# EAGLE schematic backplane2 (EAGLE 6.6.0)
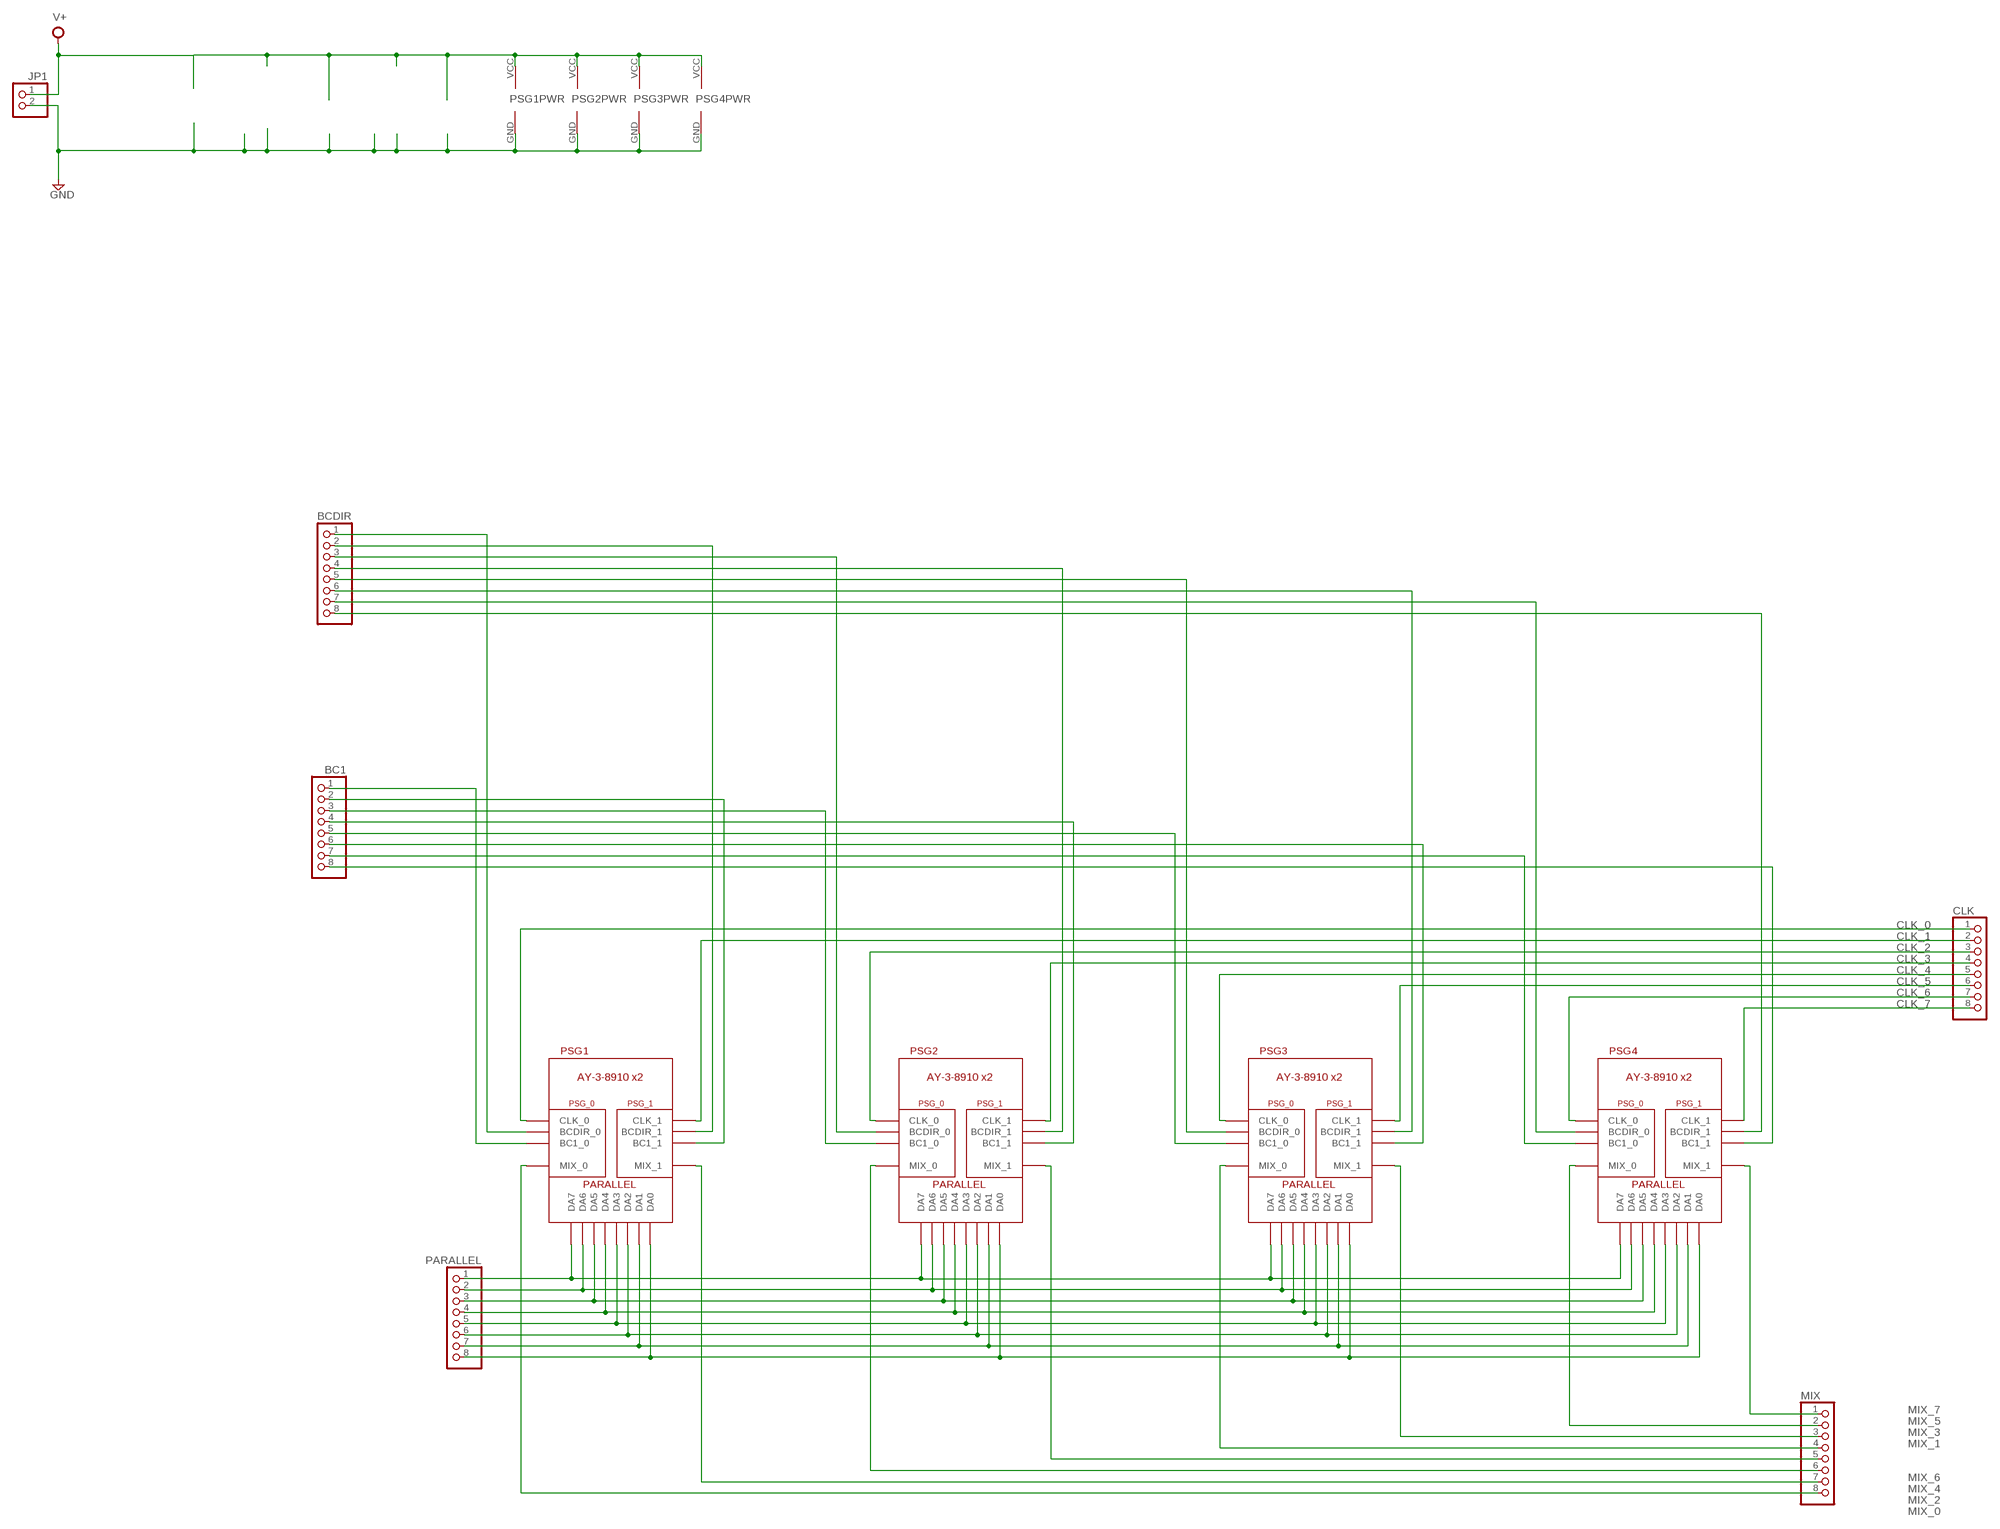
[diagram p0: schematic, sheet 1]

## Parts
BC1  PINHD-1X8  [1X08]
BCDIR  PINHD-1X8  [1X08]
CLK  PINHD-1X8  [1X08]
JP1  PINHD-1X2  [1X02]
MIX  PINHD-1X8  [1X08]
PARALLEL  PINHD-1X8  [1X08]
PSG1  DUAL_PSG_DAUGHTER  [DUAL_PSG_DAUGHTER]
PSG2  DUAL_PSG_DAUGHTER  [DUAL_PSG_DAUGHTER]
PSG3  DUAL_PSG_DAUGHTER  [DUAL_PSG_DAUGHTER]
PSG4  DUAL_PSG_DAUGHTER  [DUAL_PSG_DAUGHTER]

## Nets
3: BCDIR.4 PSG2.BCDIR_1
BC1_0: BC1.1 PSG1.BC1_0
BC1_1: BC1.2 PSG1.BC1_1
BC1_2: BC1.3 PSG2.BC1_0
BC1_3: BC1.4 PSG2.BC1_1
BC1_4: BC1.5 PSG3.BC1_0
BC1_5: BC1.6 PSG3.BC1_1
BC1_6: BC1.7 PSG4.BC1_0
BC1_7: BC1.8 PSG4.BC1_1
BCDIR_0: BCDIR.1 PSG1.BCDIR_0
BCDIR_1: BCDIR.2 PSG1.BCDIR_1
BCDIR_2: BCDIR.3 PSG2.BCDIR_0
BCDIR_4: BCDIR.5 PSG3.BCDIR_0
BCDIR_5: BCDIR.6 PSG3.BCDIR_1
BCDIR_6: BCDIR.7 PSG4.BCDIR_0
BCDIR_7: BCDIR.8 PSG4.BCDIR_1
CLK_0: CLK.1 PSG1.CLK_0
CLK_1: CLK.2 PSG1.CLK_1
CLK_2: CLK.3 PSG2.CLK_0
CLK_3: CLK.4 PSG2.CLK_1
CLK_4: CLK.5 PSG3.CLK_0
CLK_5: CLK.6 PSG3.CLK_1
CLK_6: CLK.7 PSG4.CLK_0
CLK_7: CLK.8 PSG4.CLK_1
DA0: PARALLEL.8 PSG1.DA0 PSG2.DA0 PSG3.DA0 PSG4.DA0
DA1: PARALLEL.7 PSG1.DA1 PSG2.DA1 PSG3.DA1 PSG4.DA1
DA2: PARALLEL.6 PSG1.DA2 PSG2.DA2 PSG3.DA2 PSG4.DA2
DA3: PARALLEL.5 PSG1.DA3 PSG2.DA3 PSG3.DA3 PSG4.DA3
DA4: PARALLEL.4 PSG1.DA4 PSG2.DA4 PSG3.DA4 PSG4.DA4
DA5: PARALLEL.3 PSG1.DA5 PSG2.DA5 PSG3.DA5 PSG4.DA5
DA6: PARALLEL.2 PSG1.DA6 PSG2.DA6 PSG3.DA6 PSG4.DA6
DA7: PARALLEL.1 PSG1.DA7 PSG2.DA7 PSG3.DA7 PSG4.DA7
GND: JP1.2 PSG1.GND PSG2.GND PSG3.GND PSG4.GND
MIX_0: MIX.8 PSG1.MIX_0
MIX_1: MIX.7 PSG1.MIX_1
MIX_2: MIX.6 PSG2.MIX_0
MIX_3: MIX.5 PSG2.MIX_1
MIX_4: MIX.4 PSG3.MIX_0
MIX_5: MIX.3 PSG3.MIX_1
MIX_6: MIX.2 PSG4.MIX_0
MIX_7: MIX.1 PSG4.MIX_1
V+: JP1.1 PSG1.VCC PSG2.VCC PSG3.VCC PSG4.VCC

## Library data of the parts
BC1 BCDIR CLK MIX PARALLEL = pinhead:PINHD-1X8: PIN HEADER
JP1 = pinhead:PINHD-1X2: PIN HEADER
PSG1-PSG4 = jaapie:DUAL_PSG_DAUGHTER